# EAGLE design WiFi Turntable Controller v3 (EAGLE 7.7.0)
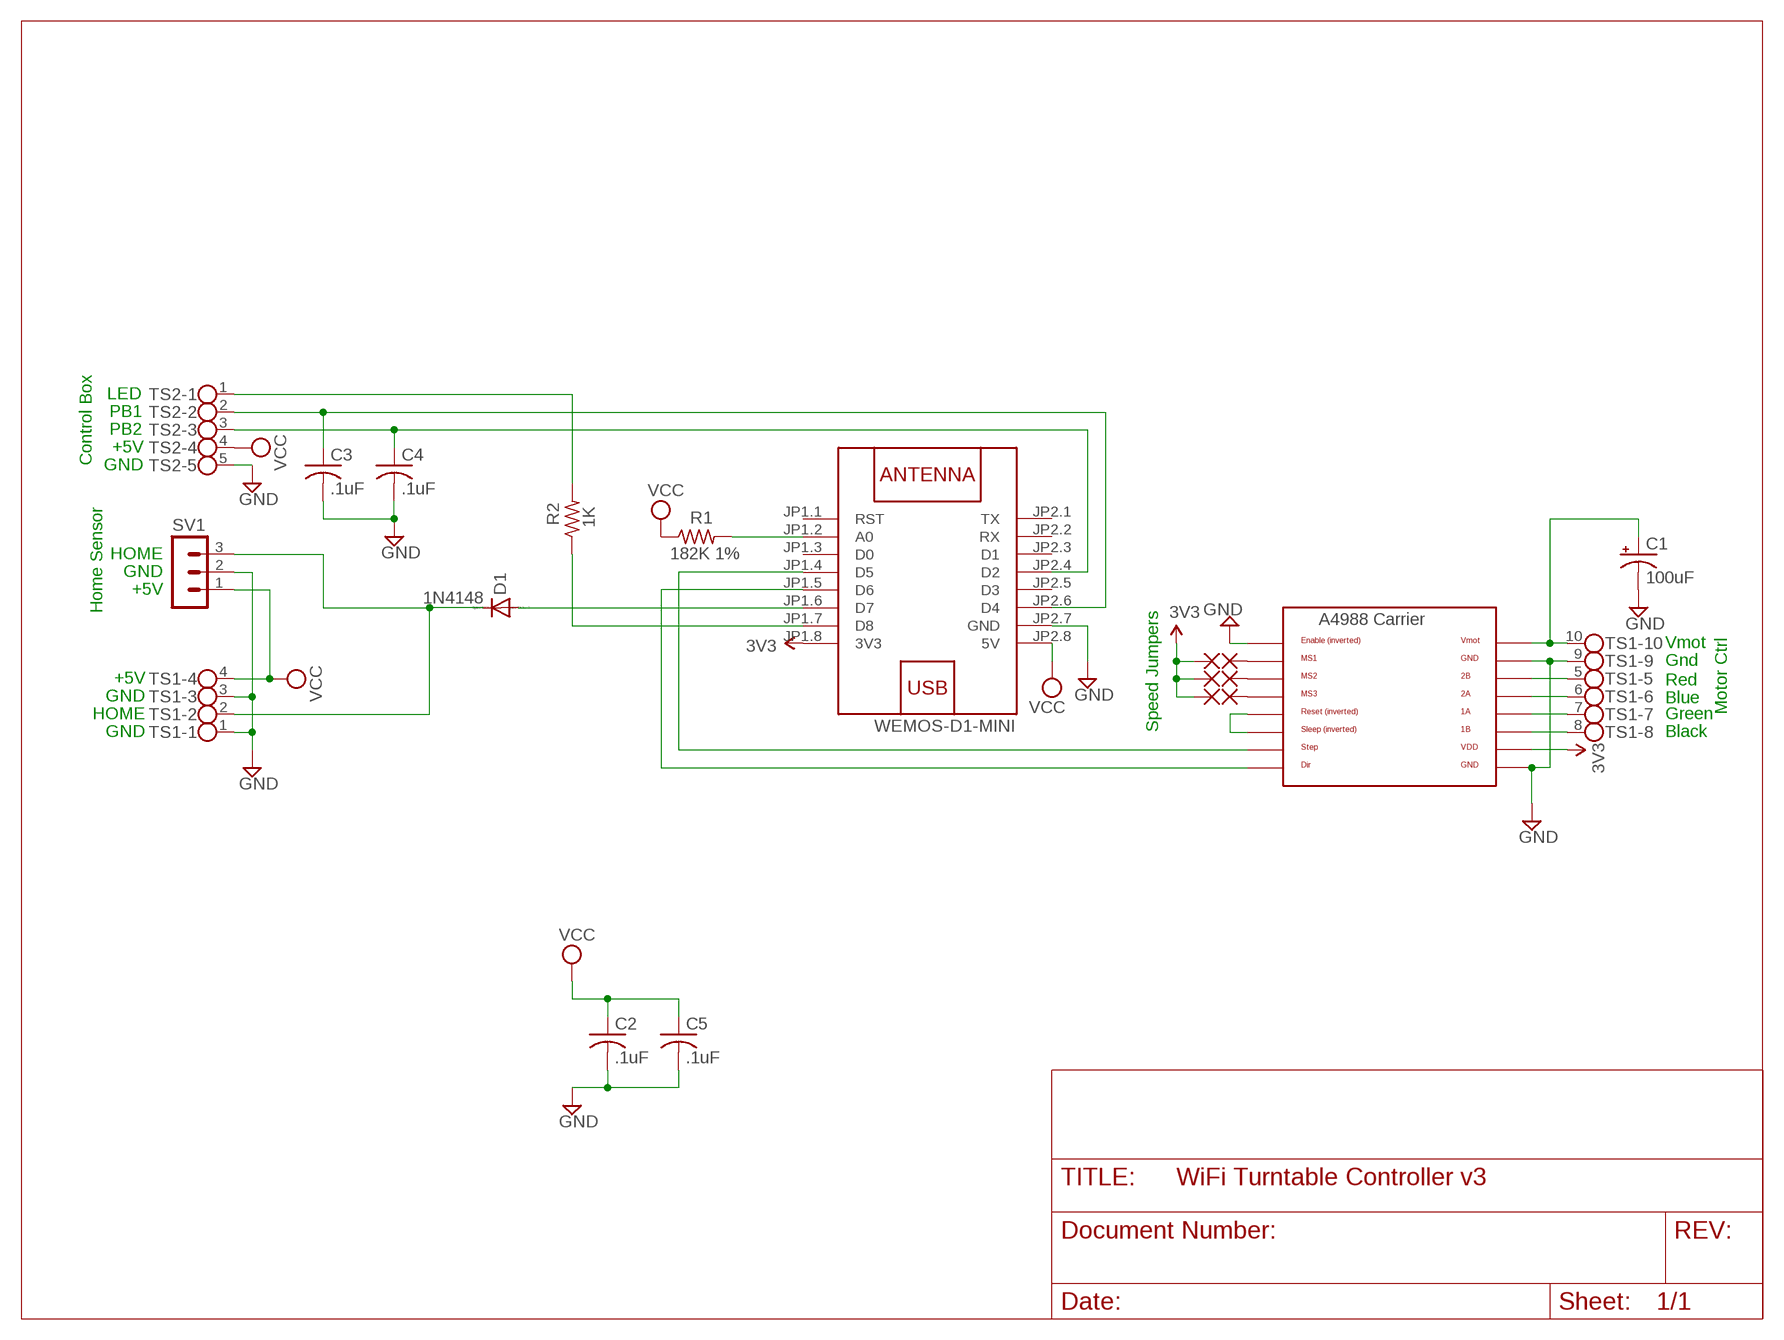
[diagram p0: schematic, sheet 1]

## Parts
C1  100uF  CPOL-USE3.5-8  [E3,5-8]
C2  .1uF  C-USC1206  [C1206]
C3  .1uF  C-USC1206  [C1206]
C4  .1uF  C-USC1206  [C1206]
C5  .1uF  C-USC1206  [C1206]
D1  1N4148  DIODE-SOD123  [SOD123]
PAD1  1,6/0,8  [1,6/0,8]
PAD2  1,6/0,8  [1,6/0,8]
PAD3  1,6/0,8  [1,6/0,8]
PAD4  1,6/0,8  [1,6/0,8]
PAD5  1,6/0,8  [1,6/0,8]
PAD6  1,6/0,8  [1,6/0,8]
R1  182K 1%  R-US_R1206  [R1206]
R2  1K  R-US_R1206  [R1206]
SV1  MA03-1  [MA03-1]
TS1  TERMBLK10  [10PB]
TS2  TERMBLK05  [05PB]
U$1  WEMOS-D1-MINI  [WEMOS-D1-MINI]
U$2  A4988BREAKOUT  [A4988BREAKOUT]

## Nets
3.3V: PAD4.1(P) PAD5.1(P) PAD6.1(P) U$1.JP1.8(3V3) U$2.VDD ; supply symbol labelled 3V3
GND: C1.- C2.2 C3.2 C4.2 C5.2 SV1.2 TS1.1 TS1.3 TS1.9 TS2.5 U$1.JP2.7(GND) U$2.EN U$2.GND U$2.GND@0(GND)
N$1: D1.A U$1.JP1.6(D7)
N$2: D1.C SV1.3 TS1.2
N$3: U$2.RST U$2.SLP(SLEEP)
N$4: U$1.JP1.4(D5) U$2.STEP
N$5: PAD1.1(P) U$2.MS1
N$6: PAD2.1(P) U$2.MS2
N$7: R1.2 U$1.JP1.2(A0)
N$8: U$1.JP1.5(D6) U$2.DIR
N$9: PAD3.1(P) U$2.MS3
N$10: TS1.5 U$2.2B
N$13: TS1.6 U$2.2A
N$14: TS1.7 U$2.1A
N$15: TS1.8 U$2.1B
N$17: R2.2 TS2.1
N$18: C3.1 TS2.2 U$1.JP2.6(D4)
N$19: C4.1 TS2.3 U$1.JP2.4(D2)
N$21: R2.1 U$1.JP1.7(D8)
VCC: C2.1 C5.1 R1.1 SV1.1 TS1.4 TS2.4 U$1.JP2.8(5V)
VMOT: C1.+ TS1.10 U$2.VMOT
Unconnected: U$1.JP1.1(RST) U$1.JP1.3(D0) U$1.JP2.1(TX) U$1.JP2.2(RX) U$1.JP2.3(D1) U$1.JP2.5(D3)

## Notes on the sheet
- LED
- PB1
- PB2
- +5V
- GND
- Control Box
- HOME
- GND
- +5V
- Home Sensor
- Vmot
- Gnd
- +5V
- GND | Red
- HOME | Blue
- Motor Ctrl
- Green
- GND
- Speed Jumpers
- Black

## Library data of the parts
C1 = rcl:CPOL-US: POLARIZED CAPACITOR, American symbol
C2-C5 = rcl:C-US: CAPACITOR, American symbol
D1 = diode:DIODE-: DIODE
PAD1-PAD6 = wirepad:1,6/0,8: THROUGH-HOLE PAD
R1 R2 = rcl:R-US_: RESISTOR, American symbol
SV1 = con-lstb:MA03-1: PIN HEADER; OC_FARNELL: unknown; OC_NEWARK: unknown
TS1 = cdb:TERMBLK10
TS2 = cdb:TERMBLK05
U$1 = diy-modules:WEMOS-D1-MINI: WEMOS D1 mini: Mini Wi-Fi Board based on ESP-8266 device More details can be found here: https://www.wemos.cc/product/d1-mini.html Click here to find device on ebay.com <http://www.ebay.com/sch/wemos+d1+mini+nodemcu>
U$2 = RepRapjr:A4988BREAKOUT

## Board
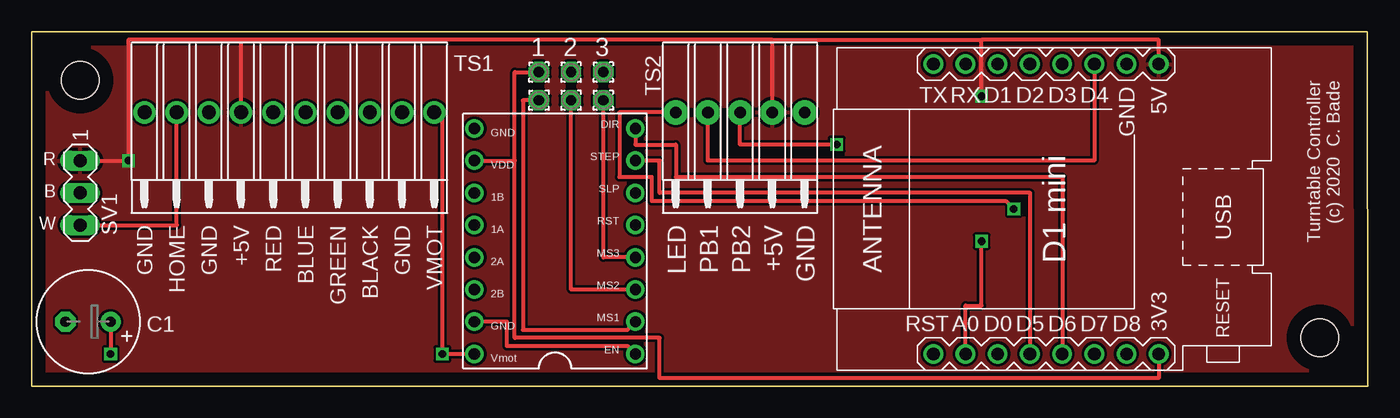
[diagram p1: board, top side]
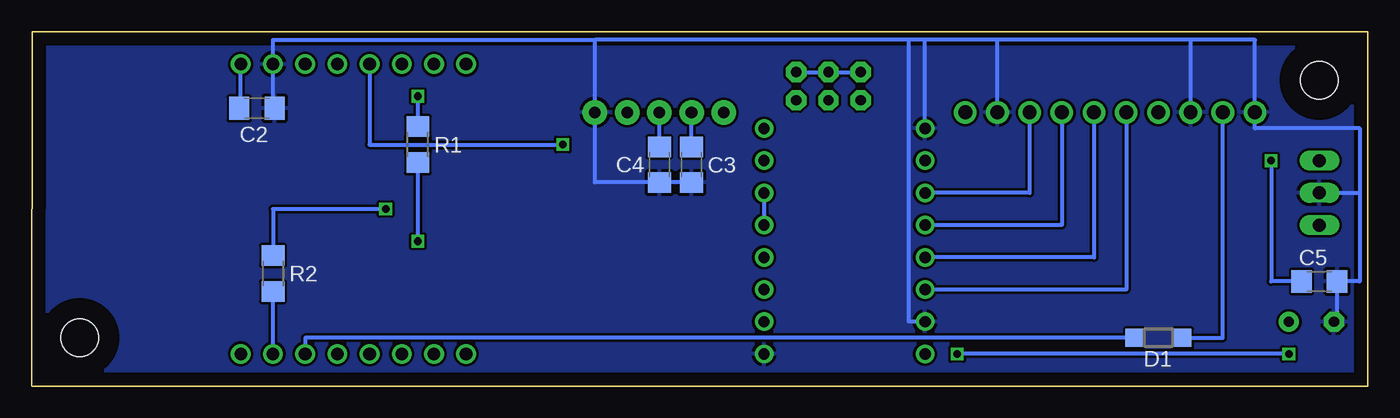
[diagram p2: board, bottom side, seen from below]

Size 105.41 x 27.95 mm. Coordinates in mm from the lower left corner, seen from the top.
Outline: 0.01,27.94 105.38,27.95 105.41,0 0,0 0.01,27.94
Copper layers (1*16): Top 0.035mm / dielectric 1.5mm / Bottom 0.035mm
Design rules "default *": minimum track width 10mil, minimum drill 10mil, track to track 8mil, track to pad 8mil, pad to pad 8mil, via to via 8mil, smd to smd 8mil, copper to edge 40mil, drill to drill 8mil, minimum pad ring 11mil, minimum via ring 8mil, stop-mask expansion 4mil, vias tented up to drill 0mil, thermal gap 10mil

### Footprints (pad centres in the part's own frame; a part is rotated, then mirrored left to right if it is on the bottom)
E3,5-8 = drill 0.813 pad 1.6: + -1.778,0 | drill 0.813 pad 1.6 octagon: - 1.778,0
C1206 = smd 1.6 x 1.8: 1 -1.4,0; 2 1.4,0
SOD123 = smd 1.4 x 1.4: A 1.9,0; C -1.9,0
1,6/0,8 = drill 0.813 pad 1.6 octagon: 1 0,0
R1206 = smd 1.6 x 1.803: 1 -1.422,0; 2 1.422,0
MA03-1 = drill 1.016 long: 1 -2.54,0; 2 0,0; 3 2.54,0
10PB = drill 1.1 pad 1.778: 1 11.43,0; 2 8.89,0; 3 6.35,0; 4 3.81,0; 5 1.27,0; 6 -1.27,0; 7 -3.81,0; 8 -6.35,0; 9 -8.89,0; 10 -11.43,0
05PB = drill 0.914 pad 1.93: 1 5.08,-1.27; 2 2.54,-1.27; 3 0,-1.27; 4 -2.54,-1.27; 5 -5.08,-1.27
WEMOS-D1-MINI = drill 1: JP1.1 -11.43,9.525; JP1.2 -11.43,6.985; JP1.3 -11.43,4.445; JP1.4 -11.43,1.905; JP1.5 -11.43,-0.635; JP1.6 -11.43,-3.175; JP1.7 -11.43,-5.715; JP1.8 -11.43,-8.255; JP2.1 11.43,9.525; JP2.2 11.43,6.985; JP2.3 11.43,4.445; JP2.4 11.43,1.905; JP2.5 11.43,-0.635; JP2.6 11.43,-3.175; JP2.7 11.43,-5.715; JP2.8 11.43,-8.255
A4988BREAKOUT = drill 0.9: 1A 8.89,1.27; 1B 11.43,1.27; 2A 6.35,1.27; 2B 3.81,1.27; DIR 16.51,-11.43; EN -1.27,-11.43; GND 16.51,1.27; GND@0 1.27,1.27; MS1 1.27,-11.43; MS2 3.81,-11.43; MS3 6.35,-11.43; RST 8.89,-11.43; SLP 11.43,-11.43; STEP 13.97,-11.43; VDD 13.97,1.27; VMOT -1.27,1.27
4-40SCREW = hole 2.997: 0,0

### Placement (x,y rotation side)
C1  4.45,5.08 180 top
C2  87.64,21.9 0 bottom
C3  53.35,17.46 270 bottom
C4  55.88,17.46 270 bottom
C5  3.82,8.25 0 bottom
D1  16.52,3.81 180 bottom
PAD1  40.02,22.54 0 top
PAD2  42.56,22.54 0 top
PAD3  45.1,22.54 0 top
PAD4  45.1,24.76 0 top
PAD5  42.56,24.76 0 top
PAD6  40.02,24.76 0 top
R1  74.94,19.05 270 bottom
R2  86.37,8.89 90 bottom
SV1  3.82,15.24 270 top
TS1  20.33,21.59 180 top
TS2  55.89,20.32 180 top
U$1  80.66,13.97 90 top
U$2  36.21,3.81 90 top
U$3  [4-40SCREW]  3.82,24.13 180 bottom
U$4  [4-40SCREW]  101.61,3.81 180 bottom

### Tracks (layer width: path | path; a pad name or v marks a point on that pad's centre or on a via)
3.3V
  Top 0.305: U$2.VDD 38.11,17.78 | 38.11,17.78 38.11,24.76 PAD6.1 | U$1.JP1.8 88.91,0.63 49.54,0.63 49.54,3.81 38.11,3.81 38.11,17.78
  Bottom 0.305: PAD4.1 PAD5.1 PAD6.1
GND
  Top 0.305: U$2.GND@0 37.48,5.08 37.48,3.17 47,3.17 U$2.EN
  Bottom 0.305: 13.98,27.3 8.9,27.3 TS1.1 8.9,20.32 0.65,20.32 0.65,15.24 | 13.98,27.3 29.22,27.3 | 29.22,27.3 34.94,27.3 | 34.94,27.3 36.21,27.3 | 36.21,27.3 60.97,27.3 | 60.97,27.3 86.37,27.3 U$1.JP2.7 86.37,21.9 C2.2 | U$2.GND 34.94,27.3 | TS1.9 29.22,27.3 | U$2.GND@0 36.21,5.08 36.21,27.3 | TS1.3 13.98,27.3 | C3.2 C4.2 60.97,16.06 TS2.5 60.97,27.3 | 0.65,15.24 0.65,8.25 C5.2 2.42,5.08 | SV1.2 0.65,15.24
  pour Bottom: -0.31,-0.64 106.06,-0.64 106.06,28.57 -0.31,28.57
N$1
  Bottom 0.305: D1.A 83.83,3.81 U$1.JP1.6
N$2
  Top 0.305: SV1.3 11.44,12.7 TS1.2
  Bottom 0.305: D1.C 11.44,3.81 TS1.2
N$3
  Bottom 0.305: U$2.SLP U$2.RST
N$4
  Top 0.305: U$1.JP1.4 78.75,15.24 49.54,15.24 49.54,17.78 U$2.STEP
N$5
  Top 0.305: PAD1.1 38.75,22.54 38.75,4.44 47,4.44 U$2.MS1
N$6
  Top 0.305: U$2.MS2 42.56,7.62 PAD2.1
N$7  (via drill 0.6)
  Top 0.305: U$1.JP1.2 73.67,6.35 74.94,6.35 v74.94,11.43
  Bottom 0.305: v74.94,11.43 R1.2
N$8
  Top 0.305: U$2.DIR 47.64,19.05 50.81,19.05 50.81,16.51 81.29,16.51 U$1.JP1.5
N$9
  Top 0.305: U$2.MS3 45.1,10.16 PAD3.1
N$10
  Bottom 0.305: TS1.5 19.06,7.62 U$2.2B
N$13
  Bottom 0.305: TS1.6 21.6,10.16 U$2.2A
N$14
  Bottom 0.305: TS1.7 24.14,12.7 U$2.1A
N$15
  Bottom 0.305: TS1.8 26.68,15.24 U$2.1B
N$17  (via drill 0.6)
  Top 0.305: TS2.1 46.37,21.59 46.37,16.51 48.91,16.51 48.91,14.6 76.85,14.6 v77.48,13.97
  Bottom 0.305: v77.48,13.97 86.37,13.97 R2.2
N$18
  Top 0.305: U$1.JP2.6 83.83,17.78 53.35,17.78 TS2.2
  Bottom 0.305: C3.1 TS2.2
N$19  (via drill 0.6)
  Top 0.305: v63.51,19.05 55.89,19.05 TS2.3
  Bottom 0.305: C4.1 TS2.3 | U$1.JP2.4 78.75,19.05 v63.51,19.05
N$21
  Bottom 0.305: U$1.JP1.7 R2.1
VCC  (via drill 0.6)
  Top 0.305: 58.43,27.3 74.94,27.3 | 74.94,27.3 88.91,27.3 U$1.JP2.8 | 58.43,27.3 16.52,27.3 | 16.52,27.3 7.63,27.3 v7.63,17.78 SV1.1 | v74.94,22.86 74.94,27.3 | TS2.4 58.43,27.3 | TS1.4 16.52,27.3
  Bottom 0.305: R1.1 v74.94,22.86 | C2.1 88.91,21.9 U$1.JP2.8 | C5.1 7.63,8.25 v7.63,17.78
  pour Top: 106.69,-1.27 -0.94,-1.27 -0.94,29.21 106.69,29.21
VMOT  (via drill 0.6)
  Top 0.305: TS1.10 32.4,21.59 v32.4,2.54 U$2.VMOT | C1.+ v6.23,2.54
  Bottom 0.305: v6.23,2.54 v32.4,2.54

### Text on the board
tPlace: Turntable Controller / (c) 2020 C. Bade | R | B | W
tNames: 1 | 2 | 3 | GND | HOME | GND | +5V | RED | BLUE | GREEN | BLACK | GND | VMOT | LED | PB1 | PB2 | +5V | GND